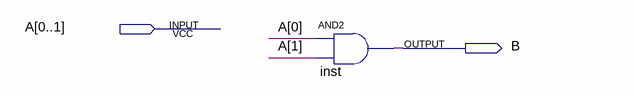
[diagram p0: schematic sheet]
// Quartus schematic testeBUS.bdf as structural Verilog: 1 symbols, 2 pins
module testeBUS (
  input  [0:1] A,
  output B
);

  and inst (B, A[0], A[1]);
endmodule
